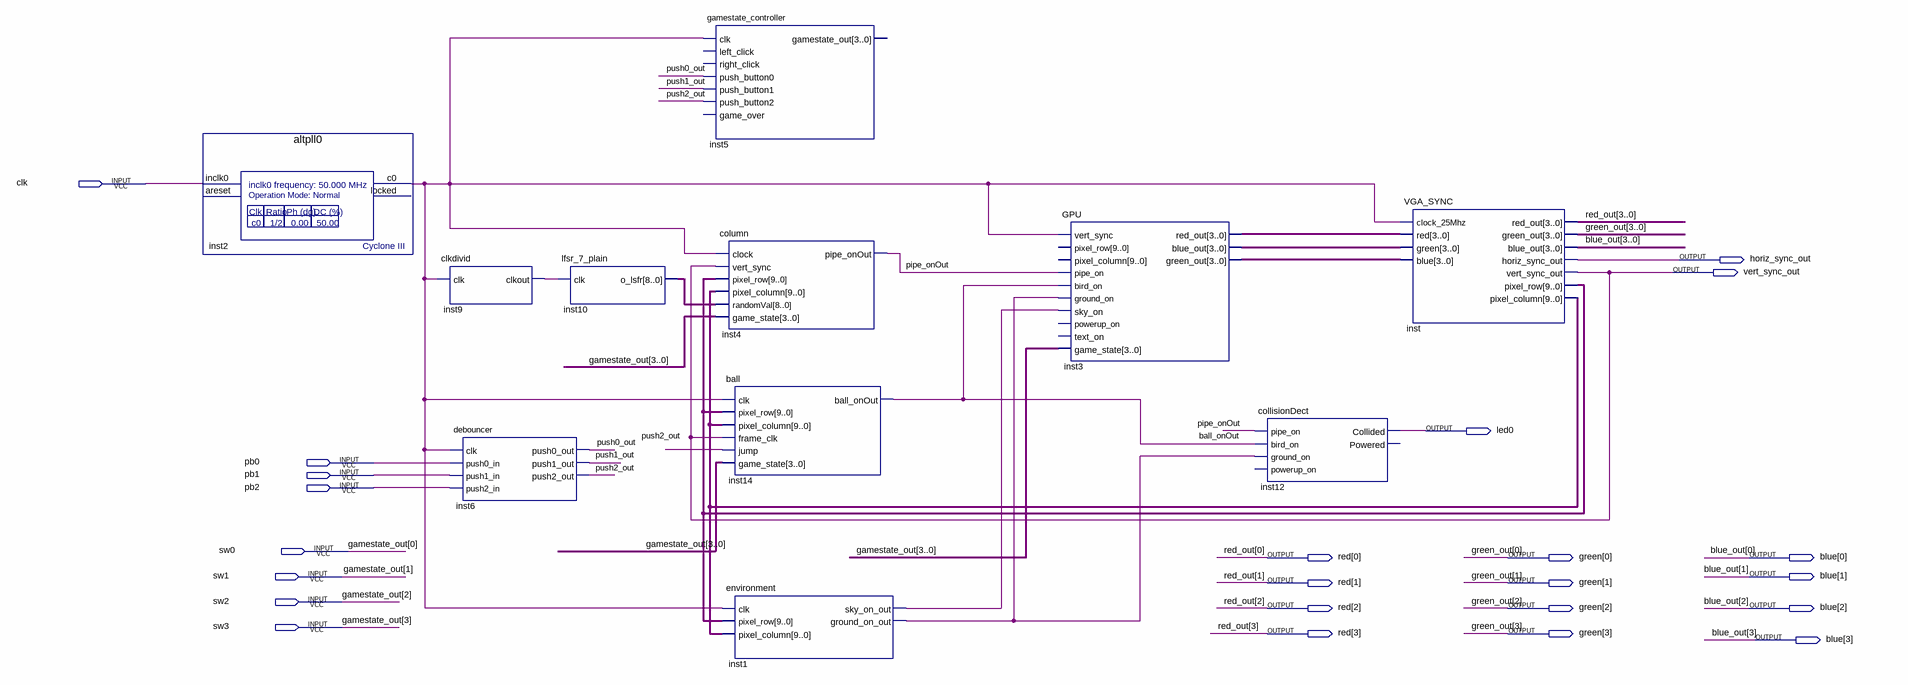
[diagram p0: schematic sheet]
// Quartus schematic flappydabird.bdf as structural Verilog: 11 symbols, 23 pins
module flappydabird (
  input  clk,
  input  pb0,
  input  pb1,
  input  pb2,
  input  sw0,
  input  sw1,
  input  sw2,
  input  sw3,
  output horiz_sync_out,
  output vert_sync_out,
  output led0,
  output [3:0] red,
  output [3:0] green,
  output [3:0] blue
);

  wire ball_onOut, inst1_ground_on_out, inst1_sky_on_out, inst2_c0, inst9_clkout, pipe_onOut, push0_out,
       push1_out, push2_out;
  wire [3:0] inst3_blue_out, inst3_green_out, inst3_red_out;
  wire [8:0] inst10_o_lsfr;
  wire [9:0] inst_pixel_column, inst_pixel_row;

  altpll0 inst2 (.inclk0(clk), .c0(inst2_c0));  // open: areset, locked
  clkdivid inst9 (.clk(inst2_c0), .clkout(inst9_clkout));
  debouncer inst6 (
    .clk(inst2_c0), .push0_in(pb0), .push1_in(pb1), .push2_in(pb2), .push0_out(push0_out),
    .push1_out(push1_out), .push2_out(push2_out));
  lfsr_7_plain inst10 (.clk(inst9_clkout), .o_lsfr(inst10_o_lsfr));
  gamestate_controller inst5 (
    .clk(inst2_c0), .push_button0(push0_out), .push_button1(push1_out), .push_button2(push2_out));  // open: left_click, right_click, game_over, gamestate_out
  column inst4 (
    .clock(inst2_c0), .vert_sync(vert_sync_out), .pixel_row(inst_pixel_row),
    .pixel_column(inst_pixel_column), .randomVal(inst10_o_lsfr), .game_state({sw3, sw2, sw1, sw0}),
    .pipe_onOut(pipe_onOut));
  ball inst14 (
    .clk(inst2_c0), .pixel_row(inst_pixel_row), .pixel_column(inst_pixel_column), .frame_clk(vert_sync_out),
    .jump(push2_out), .game_state({sw3, sw2, sw1, sw0}), .ball_onOut(ball_onOut));
  environment inst1 (
    .clk(inst2_c0), .pixel_row(inst_pixel_row), .pixel_column(inst_pixel_column),
    .sky_on_out(inst1_sky_on_out), .ground_on_out(inst1_ground_on_out));
  GPU inst3 (
    .vert_sync(inst2_c0), .pipe_on(pipe_onOut), .bird_on(ball_onOut), .ground_on(inst1_ground_on_out),
    .sky_on(inst1_sky_on_out), .game_state({sw3, sw2, sw1, sw0}), .red_out(inst3_red_out),
    .blue_out(inst3_blue_out), .green_out(inst3_green_out));  // open: pixel_row, pixel_column, powerup_on, text_on
  collisionDect inst12 (
    .pipe_on(pipe_onOut), .bird_on(ball_onOut), .ground_on(inst1_ground_on_out), .Collided(led0));  // open: powerup_on, Powered
  VGA_SYNC inst (
    .clock_25Mhz(inst2_c0), .red(inst3_red_out), .green(inst3_blue_out), .blue(inst3_green_out),
    .red_out(red), .green_out(green), .blue_out(blue), .horiz_sync_out(horiz_sync_out),
    .vert_sync_out(vert_sync_out), .pixel_row(inst_pixel_row), .pixel_column(inst_pixel_column));

  // Other names for the same wires on the sheet: blue_out[3:0] = blue; gamestate_out[3:0] = {sw3, sw2, sw1, sw0};
  //   green_out[3:0] = green; red_out[3:0] = red
endmodule
